# Altium project Tronic_Pros_V1.0.PrjPcb
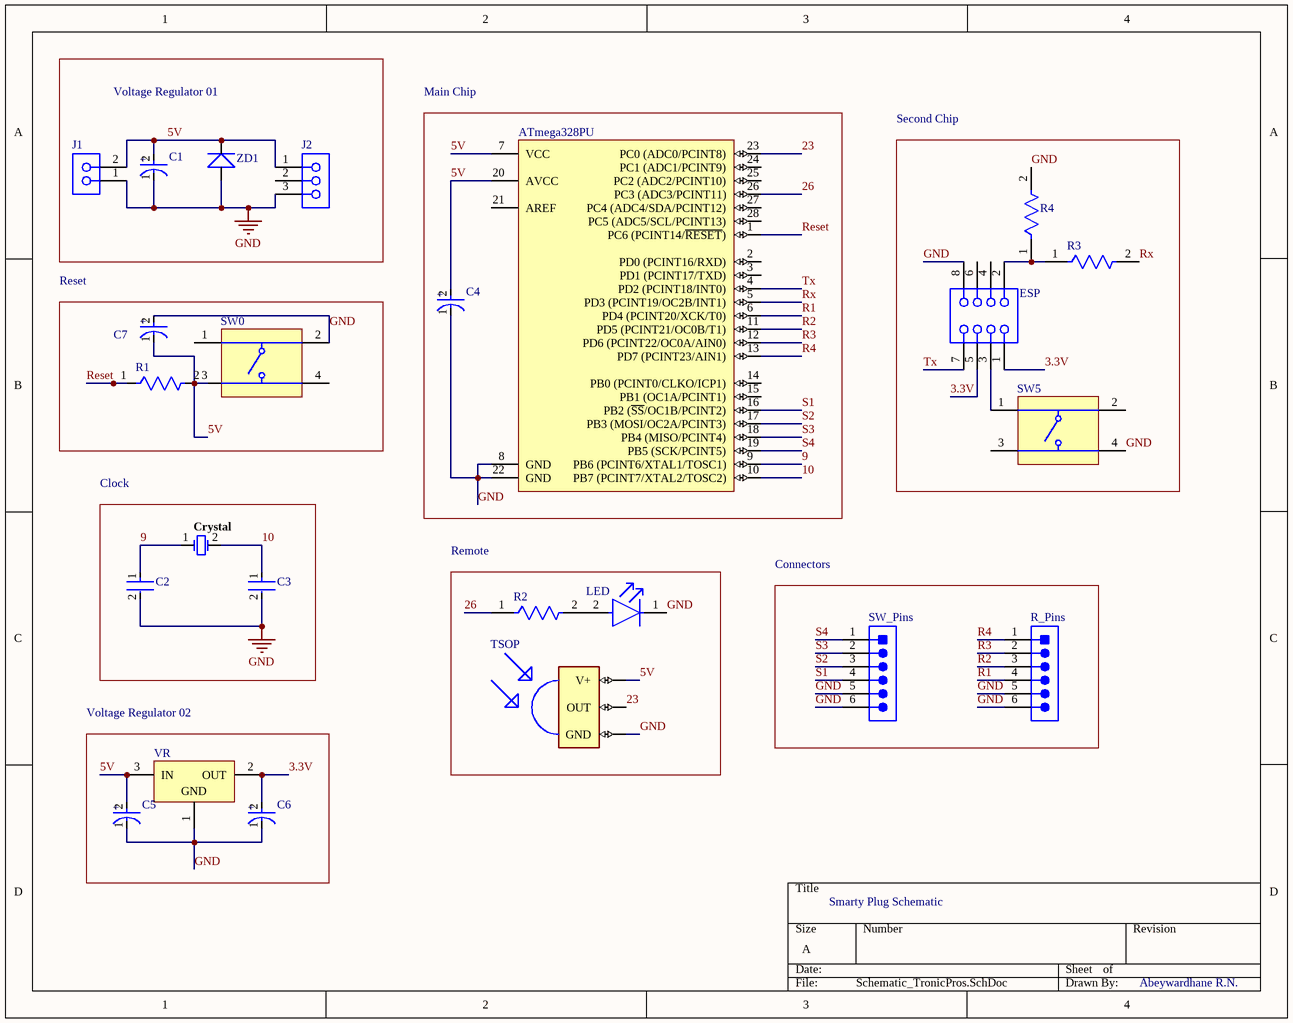
[diagram p0: Schematic_TronicPros.SchDoc]
1 sheet, 24 parts. Net scope: global (net labels, ports and power ports of the same name join across sheets).
Board file: PCB_TronicPros.PcbDoc

## Sheet Schematic_TronicPros.SchDoc
size A; SheetNumber: 1; SheetTotal: 1

### Parts
ATmega328PU  ATmega328-PU  [28P3]  (value not drawn)
C1  ECA1HHG100I  [FP-RAD-TH-D_5_0_5-L_11_1-MFG]  (value not drawn)
C2  RCE5C1H101J0K1H03B  [FP-RCE0K1-MFG]  (value not drawn)
C3  RCE5C1H101J0K1H03B  [FP-RCE0K1-MFG]  (value not drawn)
C4  ECA1HHG100I  [FP-RAD-TH-D_5_0_5-L_11_1-MFG]  (value not drawn)
C5  ECA1HHG100I  [FP-RAD-TH-D_5_0_5-L_11_1-MFG]  (value not drawn)
C6  ECA1HHG100I  [FP-RAD-TH-D_5_0_5-L_11_1-MFG]  (value not drawn)
C7  ECA1HHG100I  [FP-RAD-TH-D_5_0_5-L_11_1-MFG]  (value not drawn)
Crystal  FOXSLF/120-20  [FOX-FOXSLF-2_V]  (value not drawn)
ESP  SSW-104-02-G-D  [SMTC-SSW-104-02-X-D]  (value not drawn)
J1  SSW-102-02-T-S  [SMTC-SSW-102-02-X-S]  (value not drawn)
J2  SLW-103-01-T-S  [SMTC-SLW-103-01-X-S]  (value not drawn)
LED  SFH 4550  [FP-SFH_4550-MFG]  (value not drawn)
R1  MBB02070C1002FCT00  [FP-MBB0207-MFG]  (value not drawn)
R2  MBB02070C1002FCT00  [FP-MBB0207-MFG]  (value not drawn)
R3  MBB02070C1002FCT00  [FP-MBB0207-MFG]  (value not drawn)
R4  MBB02070C1002FCT00  [FP-MBB0207-MFG]  (value not drawn)
R_Pins  22-23-2061  [MOLX-22-23-2061_V]  (value not drawn)
SW0  1825910-6  [TECO-1825910-6_V]  (value not drawn)
SW5  1825910-6  [TECO-1825910-6_V]  (value not drawn)
SW_Pins  22-23-2061  [MOLX-22-23-2061_V]  (value not drawn)
TSOP  TSOP1838  [TSOP18XX]  (value not drawn)
VR  LM1117T-3.3  [T03B]  (value not drawn)
ZD1  DIP-DIODE-ZENER-3.6V-500MW(DO-35)  [DO-35]  (value not drawn)

### Blocks framed on the sheet
Voltage Regulator 01: C1 J1 J2 ZD1
Main Chip: ATmega328PU C4
Second Chip: ESP R3 R4 SW5
Reset: C7 R1 SW0
Clock: C2 C3 Crystal
Remote: LED R2 TSOP
Connectors: R_Pins SW_Pins
Voltage Regulator 02: C5 C6 VR

### Nets
GND: ATmega328PU.8(GND) ATmega328PU.22(GND) C1.1(C) C2.2 C3.2 C4.1(C) C5.1(C) C6.1(C) C7.2(A) ESP.8 J1.1 J2.3 LED.1(C) R4.2 R_Pins.5 R_Pins.6 SW0.2 SW5.4 SW_Pins.5 SW_Pins.6 TSOP.GND VR.1(GND) ZD1.A(POS)
3.3V: C6.2(A) ESP.1 ESP.5 VR.2(OUT)
5V: ATmega328PU.7(VCC) ATmega328PU.20(AVCC) C1.2(A) C4.2(A) C5.2(A) C7.1(C) J1.2 J2.1 R1.2 SW0.3 TSOP.VCC(V+) VR.3(IN) ZD1.C(NEG)
9: ATmega328PU.9(PB6_(PCINT6/XTAL1/TOSC1)) C2.1 Crystal.1
10: ATmega328PU.10(PB7_(PCINT7/XTAL2/TOSC2)) C3.1 Crystal.2
23: ATmega328PU.23(PC0_(ADC0/PCINT8)) TSOP.OUT
26: ATmega328PU.26(PC3_(ADC3/PCINT11)) R2.1
\: ATmega328PU.1(PC6_(PCINT14/~{RESET})) R1.1  [also labelled Reset]
R1: ATmega328PU.6(PD4_(PCINT20/XCK/T0)) R_Pins.4
R2: ATmega328PU.11(PD5_(PCINT21/OC0B/T1)) R_Pins.3
R3: ATmega328PU.12(PD6_(PCINT22/OC0A/AIN0)) R_Pins.2
R4: ATmega328PU.13(PD7_(PCINT23/AIN1)) R_Pins.1
Rx: ATmega328PU.5(PD3_(PCINT19/OC2B/INT1)) R3.2
S1: ATmega328PU.16(PB2_(~{SS}/OC1B/PCINT2)) SW_Pins.4
S2: ATmega328PU.17(PB3_(MOSI/OC2A/PCINT3)) SW_Pins.3
S3: ATmega328PU.18(PB4_(MISO/PCINT4)) SW_Pins.2
S4: ATmega328PU.19(PB5_(SCK/PCINT5)) SW_Pins.1
Tx: ATmega328PU.4(PD2_(PCINT18/INT0)) ESP.7
NetESP_2: ESP.2 R3.1 R4.1
NetESP_3: ESP.3 SW5.1
NetLED_2: LED.2(A) R2.2

Not connected (* = marked no-connect by the designer): ATmega328PU 2(PD0_(PCINT16/RXD)) 3(PD1_(PCINT17/TXD)) 14(PB0_(PCINT0/CLKO/ICP1)) 15(PB1_(OC1A/PCINT1)) 21(AREF) 24(PC1_(ADC1/PCINT9)) 25(PC2_(ADC2/PCINT10)) 27(PC4_(ADC4/SDA/PCINT12)) 28(PC5_(ADC5/SCL/PCINT13)); ESP 4 6; J2 2; SW0 1 4; SW5 2 3

### Notes on the sheet
- Smarty Plug Schematic
- Abeywardhane R.N.
- (in symbol CMP-05427-000260-1) +

### Library data of the parts
ATmega328PU = CMP-0095-00015-2: 8-bit AVR Microcontroller, 32KB Flash, 1KB EEPROM, 2KB SRAM, 28-pin PDIP, Industrial Grade (-40°C to 85°C); ComponentLink3Description: ATmega48A/48PA/88A/88PA/168A/168PA/328/328P Summary; RevisionNote: DatasheetVersion updated. URLs added.; DatasheetVersion: revD, May-2011; ComponentLink1URL: http://www.atmel.com/; PackageVersion: revB, Sep-2001; PackageDescription: 28-lead (0.300"/7.62mm Wide) Plastic Dual Inline Package (PDIP); PackageReference: 28P3; ComponentLink1Description: Manufacturer URL; ComponentLink2Description: ATmega48A/48PA/88A/88PA/168A/168PA/328/328P Datasheet; ComponentLink3URL: http://www.atmel.com/dyn/resources/prod_documents/8271S.pdf; ComponentLink2URL: http://www.atmel.com/dyn/resources/prod_documents/8271.pdf
C1 C4-C7 = CMP-05427-000260-1: Aluminum Electrolytic Capacitors (Radial Lead Type) AEC-Q200 Qualified 10uF ±20% 50V; Lead Diameter: 0.5mm; Polarity: Polar; Leakage Current: 3uA; Life (Hours): 1000Hour; Ripple Current: 39mA; Lead/Base Style: Straight; Max Operating Temperature: 105°C; Voltage Rating (DC): 50V; Diameter: 5mm; RoHS Compliant: Yes; Capacitance: 10uF; Packaging: Ammo Pack; Series: NHG; Construction: RADIAL; Length: 11mm; Tolerance: 20%; Height - Seated (Max): 0.472inch; Contact Plating: Tin; Height: 11mm; Min Operating Temperature: -55°C; Radiation Hardening: No; Package Quantity: 2000; Mount: Through Hole; Voltage Rating: 50V; Lead Pitch: 2.5mm; Termination: Radial; Lead Free: Lead Free; Case/Package: Radial
C2 C3 = CMP-06035-040252-1: Cap Ceramic 100pF 50V C0G ±5% Radial 5mm +125°C Automotive Bulk; Lead Diameter: 0.5mm; Lead/Base Style: Formed Leads; Mount: Through Hole; Height: 3.5mm; Voltage Rating: 50V; Lead Pitch: 0.197inch; Packaging: Bulk; Capacitance: 100pF; Height - Seated (Max): 0.138inch; Length: 0.142inch; Max Operating Temperature: 125°C; Resistor Type: Ceramic; Case/Package: Radial; Package Quantity: 500; Voltage Rating (DC): 50V; Tolerance: 5%; Width: 2.5mm; Termination: Radial; Ratings: AEC-Q200; Dielectric: C0G; Min Operating Temperature: -55°C
Crystal = CMP-1749-00004-1: Resistance Weld Thru-Hole Crystal, 12 MHz, +/-30 ppm, -20 to 70 degC, 2-Pin THD, RoHS, Bulk; Elements: 1; Rds On Max: 115 mohm; Typical Rise Time: 90 ns; Max Power Dissipation: 2.5 W; Case\Package: TO-251-3; Input Capacitance: 350 pF; REACH SVHC: No SVHC; Length: 6.6 mm; ComponentLink1URL: http://www.foxonline.com/; PackageDescription: 2-Pin Through Hole Device, Body 11.35 x 4.65 mm, Pitch 4.88 mm; Radiation Hardening: No; Package Quantity: 70; Packaging: Rail/Tube; ComponentLink1Description: Manufacturer URL; Min Operating Temperature: -55 degC; Max Operating Temperature: 150 degC; RoHSCompliant: true; PackageReference: FOXSLF-2; DatasheetVersion: Mar-15; Pins: 3; Height: 6.1 mm; Mount: Through Hole; ComponentLink2URL: http://www.foxonline.com/pdfs/hc49slf.pdf; ComponentLink2Description: Datasheet; Width: 2.3 mm
ESP = CMP-1023-00343-1: SQ Post Socket, Through-hole, Vertical, -55 to 125 degC, 2.54mm Pitch, 8-Pin, Female, RoHS; Manufacturer: Samtec; Mounting Technology: Through-hole; ComponentLink1Description: Manufacturer URL; Orientation: Vertical; Pitch: 2.54 mm; PartNumber: SSW-104-02-G-D; ComponentLink2URL: http://www.samtec.com/documents/webfiles/pdf/SSW_TH.PDF; PackageReference: SSW-104-02-X-D; ComponentLink3Description: Package Specification; PackageVersion: CA, 6/1987; PackageDescription: Assembly, Socket Strip .016 X .031 Tail; ComponentLink2Description: Datasheet; RoHS: True; ComponentLink1URL: http://www.samtec.com; ComponentLink3URL: http://www.samtec.com/documents/webfiles/cpdf/SSW-1XX-XX-XXX-X-XX-XXX-XX-MKT.pdf; DatasheetVersion: F-214; Temperature Range: -55 to 125 degC
J1 = CMP-1023-00323-1: SQ Post Socket, Through-hole, Vertical, -55 to 105 degC, 2.54 mm Pitch, 2-Pin, Female, RoHS; Manufacturer: Samtec; Pitch: 2.54 mm; ComponentLink3Description: Package Specification; ComponentLink2Description: Datasheet; ComponentLink1Description: Manufacturer URL; PackageVersion: CA, 6/1987; DatasheetVersion: F-214; PackageDescription: Assembly, Socket Strip .016 X .031 Tail; ComponentLink2URL: http://www.samtec.com/documents/webfiles/pdf/SSW_TH.PDF; RoHS: True; ComponentLink3URL: http://www.samtec.com/documents/webfiles/cpdf/SSW-1XX-XX-XXX-X-XX-XXX-XX-MKT.pdf; ComponentLink1URL: http://www.samtec.com; PackageReference: SSW-102-02-X-S; Mounting Technology: Through-hole; Orientation: Vertical; Temperature Range: -55 to 105 degC; PartNumber: SSW-102-02-T-S
J2 = CMP-1023-00129-1: Low Profile Socket Strips, Through-hole, Vertical, -55 to 105 degC, 2.54 mm Pitch, 3-Pin, Female, RoHS; Manufacturer: Samtec; Pitch: 2.54 mm; ComponentLink1Description: Manufacturer URL; ComponentLink3Description: Package Specification; Mounting Technology: Through-hole; ComponentLink2URL: http://www.samtec.com/documents/webfiles/pdf/SLW.PDF; Orientation: Vertical; ComponentLink3URL: http://www.samtec.com/documents/webfiles/cpdf/SLW-1XX-01-X-X-MKT.pdf; PackageDescription: Low Profile Socket Strip; PackageVersion: X, 9/1987; RoHS: True; DatasheetVersion: F-214; ComponentLink1URL: http://www.samtec.com; PartNumber: SLW-103-01-T-S; PackageReference: SLW-103-01-X-S; Temperature Range: -55 to 105 degC; ComponentLink2Description: Datasheet
LED = CMP-62016-000011-1: EMITTER IR 860NM 100MA RADIAL; Manufacturer: Osram Opto; Forward Voltage: 1.5V; Reverse Voltage: 5V; Viewing Angle: 6°; Led Orientation: Straight; Mouser Description: Infrared Emitters - High Power Infrared 850 nm HALF ANGLE +/-3DEG; RoHS: TRUE; Manufacturer Part Number: SFH 4550; Forward Current: 100mA; Octopart: https://octopart.com/sfh+4550-osram+opto-55410894; ComponentLink2Description: Datasheet; Lead Free: Yes; Temperature: -40°C to +100°C; ComponentLink2URL: https://dammedia.osram.info/media/resource/hires/osram-dam-5580407/SFH%204550_EN.pdf; Device Class L2: LEDs; Temperature Range Low: -40°C; Digikey Description: EMITTER IR 860NM 100MA RADIAL; Temperature Range High: +100°C; Device Class L3: unset; Peak Emmision Wavelength: 860nm; Category: Diode; Package: SFH 4550; Device Class L1: Optoelectronics; Automotive: No; Colour: Infrared
R1-R4 = CMP-02408-000035-1: RES 10K OHM 0.6W 1% AXIAL; Voltage Rating: 300V; Resistance: 10kR; Max Power Dissipation: 600mW; Temperature Coefficient: 50ppm/°C; Radiation Hardening: No; Case/Package: Conformal; Termination: Axial; Military Standard: Not; Length: 6.5mm; Voltage Rating (DC): 300V; RoHS Compliant: Yes; Number of Terminations: 2; Packaging: Tape and Reel; Features: Automotive AEC-Q200; Tolerance: 1%; Min Operating Temperature: -55°C; Power Rating: 600mW; Lead Free: Lead Free; Resistor Type: Metal Film; Construction: Cylindrical; Series: MBB 0207 - Professional; Max Operating Temperature: 155°C; Diameter: 2.5mm; Resistance Tolerance: 1%; Contact Plating: Tin; Technology: THIN FILM
R_Pins SW_Pins = CMP-2000-05536-1: Male Header, Pitch 2.54 mm, 1 x 6 Position, Height 10.67 mm, Tail Length 3.56 mm, 0 to 70 degC, RoHS, Bulk; Manufacturer: Molex; Pitch: 2.54mm; Mounting Angle: Vertical; Current Rating: 4A; Number of Positions / Contacts: 6; Voltage Rating: 250V; Packaging: Bulk; Package Description: Male Header, Pitch 2.54 mm, 1 x 6 Position, Height 10.67 mm, Tail Length 3.56 mm; Number of Rows: 1; Type: PinStrip; Contact Material: Brass; Product Category: .100K.K.Connectors; Factory Pack Quantity: 1000; Mounting Style: ThroughHole; RoHS: Details; Contact Plating: Tin; Housing Material: Nylon; Mounting Technology: ThroughHole; Termination Style: ThroughHole; Tradename: KK; Number of Positions: 6; Brand: Molex; Product Type: Headers; Series: 6373; Datasheet URL: https://datasheet.ciiva.com/19460/232303-19460895.pdf; Package Reference: 22-23-2061; Datasheet Version: Rev. P, 09/2001; Manufacturer URL: http://www.molex.com/
SW0 SW5 = CMP-1684-00021-1: Tact Switch, SPST-NO, 0.05 A, -35 to 85 degC, 4-Pin THD, RoHS, Bulk; Manufacturer: TE Connectivity; Maximum Contact Resistance: 100mOhm; Mechanical Life: 100000Cycles; Bushing Type: Unthreaded; Switch Configuration: OFF(ON); Maximum DC Voltage Rating: 24V; Contact Rating @ Voltage: 0.05A@24VDC; Actuator Color: Black; Body Orientation: Straight; Function: MomentaryContact; Illumination: N/R; Actuator Style: RoundButton; Actuator Material: PolybutyleneTerephthalate; Dielectric Strength: 500VAC; Pole Throw Configuration: SPST; Actuator Length: 1.4mm; Product Weight: N/A; Contact Material: CopperAlloy; Housing Material: N/A; Terminal Type: PCPins; Minimum Insulation Resistance: 100MOhm; Package Description: 4-Pin Through Hole Device, Body 5.99 x 5.99 mm, Pitch 6.5 mm; Part No: 1825910-6; Package Reference: THD; Base Material: N/A; Manufacturer URL: http://www.te.com; Contact Plating: Silver; RoHS: Yes; Datasheet Version: Rev. C9; Electrical Life: 100000Cycles; Maximum AC Voltage Rating: N/A; Thread Size: N/R; Operating Temperature: -35to85C; Mounting: ThroughHole; Dimension: 5.99x5mm; Datasheet URL: http://www.te.com/commerce/DocumentDelivery/DDEController?Action=showdoc&DocId=Customer+Drawing%7F1825910%7FC9%7Fpdf%7FEnglish%7FENG_CD_1825910_C9.pdf%7F1825910-6; Family: 1825910; Seal Location: N/A; Seal Description: N/A; Packaging: N/A
TSOP = TSOP1838: IR Receiver and Demodulator; Value: *; MP: TSOP1838; Package: None; Availability: Unavailable; Price: None
VR = CMP-0062-02490-2: 800mA Low-Dropout Linear Regulator, 3-pin TO-220; Manufacturer: National Semiconductor; PowerWise: N; CompType: LDO IC; PackageTopMarking: NSUZXYTTE#*LM1117T*3.3; ComponentLink1Description: LM1117 Datasheet; RoHS: N; PinCount: 3; DatasheetVersion: Apr-2006; PackageDescription: TO-220, Molded, 3 Lead, Straight; ComponentLink2URL: http://www.national.com/pf/LM/LM1117.html; ComponentLink2Description: LM1117 Web Page; RevisionNote: Component URLs added; ComponentLink3Description: T03B Package Page; PackageReference: T03B; ComponentLink1URL: http://www.national.com/ds/LM/LM1117.pdf; PackageVersion: revL, Jan-1992; ComponentLink3URL: http://www.national.com/packaging/folders/t03b.html
ZD1 = DIP-DIODE-ZENER-3.6V-500MW(DO-35): Zener Diode 3.6V 500mW Â±5% Through Hole DO-35; MP: 1N5227B-TP; MF: Micro Commercial; Availability: Unavailable; Price: None; Value: *; SnapEDA_Link: https://www.snapeda.com/parts/1N5227B-TP/Micro%20Commercial/view-part/214543/?ref=snap; Package: DO-35 MCC